# Altium schematic sheet Analog Channel.SchDoc
size A
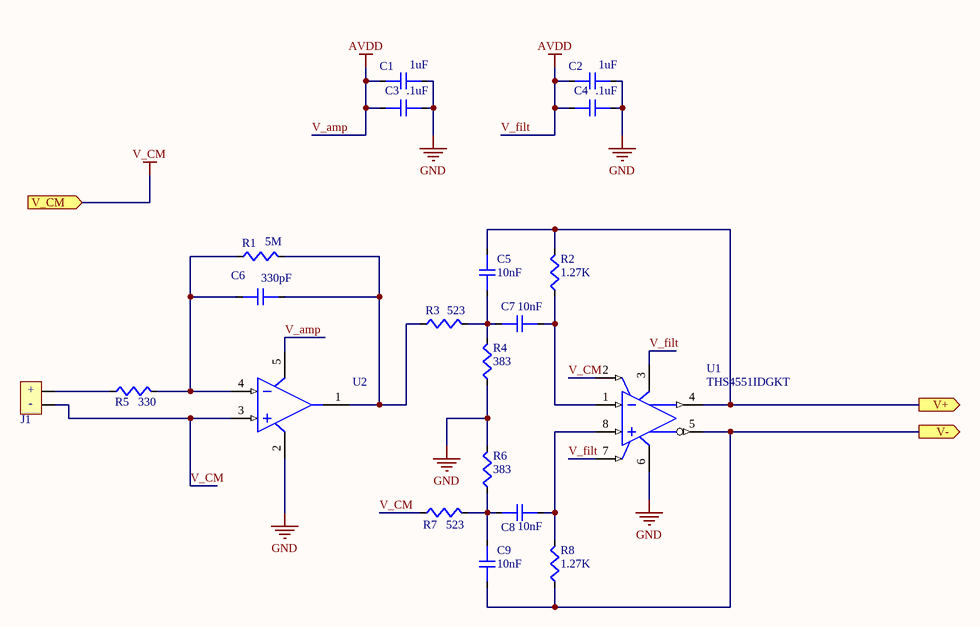
[diagram p0: Analog Channel.SchDoc]

## Parts
C1  1uF  [C0603]
C2  1uF  [C0603]
C3  .1uF  [C0603]
C4  .1uF  [C0603]
C5  10nF  [C0603]
C6  330pF  [C0603]
C7  10nF  [C0603]
C8  10nF  [C0603]
C9  10nF  [C0603]
J1  J  [EPC.00.250.NTN]  (value not drawn)
R1  5M  [R0603]
R2  1.27K  [R0603]
R3  523  [R0603]
R4  383  [R0603]
R5  330  [R0603]
R6  383  [R0603]
R7  523  [R0603]
R8  1.27K  [R0603]
U1  THS4551IDGKT  [8-VSSOP-THS4551]
U2  OPA320  [SOT-23-5]  (value not drawn)

## Ports
V+ (out), V- (out), V_CM (in)

## Nets
GND: C1.1 C2.1 C3.2 C4.2 R4.1 R6.2 U1.6(VS-) U2.2(VS-)
V_amp: C1.2 C2.2 C3.1 C4.1 U1.3(VS+) U1.7(~{PD}) U2.5(VS+)  [also labelled AVDD, V_filt]
V_CM: J1.2 R7.1 U1.2(VOCM) U2.3(+IN) ; port V_CM
V+: C5.2 R2.2 U1.4(VOUT+) ; port V+
V-: C9.1 R8.1 U1.5(VOUT-) ; port V-
NetC5_1: C5.1 C7.1 R3.2 R4.2
NetC6_1: C6.1 R1.1 R5.2 U2.4(-IN)
NetC6_2: C6.2 R1.2 R3.1 U2.1(OUT)
NetC7_2: C7.2 R2.1 U1.1(VIN-)
NetC8_1: C8.1 C9.2 R6.1 R7.2
NetC8_2: C8.2 R8.2 U1.8(VIN+)
NetJ1_1: J1.1 R5.1

## Notes on the sheet
- (in symbol hydrophone_connector) +; -

## Library data of the parts
C1 C2 = CL10B105KO8NNNC: Cap Ceramic 1uF 16V X7R 10% SMD 0603 125C T/R; Manufacturer 1: Samsung; Supplier 1: Digi-Key; Supplier Part Number 1: 1276-1019-1-ND; Manufacturer Part Number 1: CL10B105KO8NNNC; Stock 1: 4048324; Pricing 1: 1=0.10000, 10=0.04800, 100=0.02120, 500=0.01516, 1000=0.01192 (USD); RoHS: Yes; Mount: Surface Mount; Case/Package: 0603; Case Code (Metric): 1608; Case Code (Imperial): 0603; Material: Ceramic; Min Operating Temperature: -55°C; Max Operating Temperature: 125°C; Packaging: Tape and Reel; Tolerance: 10%; Capacitance: 1uF; Voltage Rating: 16V; Dielectric: X7R; Voltage: 16V; Voltage Rating (DC): 16V; Length: 1.6mm; Height: 0.8mm; Width: 0.031inch; Thickness: 0.035inch; Depth: 0.8mm; Radiation Hardening: No; Lead Free: Lead Free; ComponentLink1URL: https://datasheet.ciiva.com/15195/getdatasheetpartid-357418-15195728.pdf?src-supplier=Verical; ComponentLink1Description: https://datasheet.ciiva.com/15195/getdatasheetpartid-357418-15195728.pdf?src-supplier=Verical; ComponentLink2URL: https://datasheet.ciiva.com/29198/458176-da-01-en-vs-kondensator-0603-29198478.pdf?src-supplier=Conrad; ComponentLink2Description: https://datasheet.ciiva.com/29198/458176-da-01-en-vs-kondensator-0603-29198478.pdf?src-supplier=Conrad
C3 C4 = VJ0603Y104JXJCW1BC: 0603 0.1 uF 16 V ±5 % Tolerance X7R SMT Multilayer Ceramic Chip Capacitor; Manufacturer 1: Vishay Vitramon; Dielectric Material: Tantalum; Tolerance: 5%; Capacitance: 100nF; Voltage Rating: 16V; Supplier 1: Digi-Key; Supplier Part Number 1: 720-1685-1-ND; Manufacturer Part Number 1: VJ0603Y104JXJCW1BC; Stock 1: 6936; Pricing 1: 1=0.20000, 10=0.13400, 100=0.06780, 500=0.04636, 1000=0.04101 (USD); RoHS: Yes; Mount: Surface Mount; Case/Package: 0603; Number of Pins: 2; Case Code (Imperial): 0603; Case Code (Metric): 1608; Contact Plating: Tin,Matte; Min Operating Temperature: -55°C; Max Operating Temperature: 125°C; Packaging: Tape and Reel; Voltage Rating (DC): 16V; Package Quantity: 4000; Dielectric: X7R; Termination: SMD/SMT; Length: 1.6mm; Height: 0.95mm; Width: 0.8mm; Depth: 0.8mm; Lead Free: Lead Free; ComponentLink1URL: https://datasheet.ciiva.com/5424/vjw1bcbascomseries-223529-5424533.pdf?src-supplier=Mouser; ComponentLink1Description: https://datasheet.ciiva.com/5424/vjw1bcbascomseries-223529-5424533.pdf?src-supplier=Mouser; ComponentLink2URL: https://datasheet.ciiva.com/11491/vjw1bcbascomseries-11491768.pdf?src-supplier=Avnet; ComponentLink2Description: https://datasheet.ciiva.com/11491/vjw1bcbascomseries-11491768.pdf?src-supplier=Avnet; ComponentLink3URL: https://datasheet.ciiva.com/16215/vjw1bcbascomseries-16215161.pdf?src-supplier=Future+Electronics; ComponentLink3Description: https://datasheet.ciiva.com/16215/vjw1bcbascomseries-16215161.pdf?src-supplier=Future+Electronics
C5 C7-C9 = C0603X103F3GACAUTO: CAP CER 10000PF 25V C0G/NP0 0603; Manufacturer 1: Murata; Manufacturer Part Number 1: GRM155R71A104JA01D; Capacitance: 100nF; Tolerance: 5%; Voltage Rating: 10V; Dielectric: X7R; Stock 1: 1113659; Pricing 1: 1=0.10000, 10=0.02800, 100=0.01240, 500=0.00886, 1000=0.00696, 2500=0.00632, 5000=0.00582 (USD); RoHS: Yes; Mount: Surface Mount; Case/Package: 0402; Case Code (Imperial): 0402; Case Code (Metric): 1005; Min Operating Temperature: -55°C; Max Operating Temperature: 125°C; Packaging: Tape and Reel; Voltage Rating (DC): 10V; Package Quantity: 10000; Termination: SMD/SMT; Length: 1mm; Height: 0.5mm; Width: 0.02inch; Thickness: 0.022inch; Depth: 0.5mm; Radiation Hardening: No; Lead Free: Lead Free; ComponentLink1URL: https://datasheet.ciiva.com/5411/product-5411135.pdf?src-supplier=Mouser; ComponentLink1Description: https://datasheet.ciiva.com/5411/product-5411135.pdf?src-supplier=Mouser; ComponentLink2URL: https://datasheet.ciiva.com/11618/c02e-11618821.pdf?src-supplier=Avnet; ComponentLink2Description: https://datasheet.ciiva.com/11618/c02e-11618821.pdf?src-supplier=Avnet; Supplier 1: Digi-Key; Supplier Part Number 1: 399-C0603X103F3GACAUTOCT-ND
C6 = CC0603KRX7R9BB331: CAP CER 330PF 50V X7R 0603; Tolerance: 10%; Insulation Resistance: 10GR; Dissipation Factor: 2.5%; RoHS: Yes; Mount: Surface Mount; Case/Package: 0603; Case Code (Imperial): 0603; Case Code (Metric): 1608; Min Operating Temperature: -55°C; Max Operating Temperature: 125°C; Capacitance: 330pF; Dielectric: X7R; Package Quantity: 1; Voltage Rating: 50V; Voltage Rating (DC): 50V; Packaging: Tape and Reel; Termination: SMD/SMT; Composition: Ceramic; Length: 1.6mm; Height: 0.8mm; Depth: 0.8mm; Width: 0.8mm; Thickness: 0.035inch; Radiation Hardening: No; REACH SVHC: Unknown; Lead Free: Lead Free; Halogen Free: Halogen Free; ComponentLink1URL: https://datasheet.ciiva.com/8033/1489800-8033879.pdf?src-supplier=Element14; ComponentLink1Description: https://datasheet.ciiva.com/8033/1489800-8033879.pdf?src-supplier=Element14; ComponentLink2URL: https://datasheet.ciiva.com/17434/upy-gphc-x7r-6-3v-to-50v-8-17434663.pdf?src-supplier=Avnet+Europe; ComponentLink2Description: https://datasheet.ciiva.com/17434/upy-gphc-x7r-6-3v-to-50v-8-17434663.pdf?src-supplier=Avnet+Europe; ComponentLink3URL: https://datasheet.ciiva.com/144/mlccorderingcode-144456.pdf?src-supplier=Digi-Key; ComponentLink3Description: https://datasheet.ciiva.com/144/mlccorderingcode-144456.pdf?src-supplier=Digi-Key; ComponentLink4URL: https://datasheet.ciiva.com/144/mlccorderingcode-144454.pdf?src-supplier=Digi-Key; ComponentLink4Description: https://datasheet.ciiva.com/144/mlccorderingcode-144454.pdf?src-supplier=Digi-Key; ComponentLink5URL: https://datasheet.ciiva.com/144/mlccorderingcode-144455.pdf?src-supplier=Digi-Key; ComponentLink5Description: https://datasheet.ciiva.com/144/mlccorderingcode-144455.pdf?src-supplier=Digi-Key; ComponentLink6URL: https://datasheet.ciiva.com/11465/upy-gphc-x7r-6-3v-to-50v-8-11465240.pdf?src-supplier=Avnet; ComponentLink6Description: https://datasheet.ciiva.com/11465/upy-gphc-x7r-6-3v-to-50v-8-11465240.pdf?src-supplier=Avnet; ComponentLink7URL: https://datasheet.ciiva.com/8033/1489800-8033881.pdf?src-supplier=Element14; ComponentLink7Description: https://datasheet.ciiva.com/8033/1489800-8033881.pdf?src-supplier=Element14; ComponentLink8URL: https://datasheet.ciiva.com/7978/1489800-7978174.pdf?src-supplier=Element14; ComponentLink8Description: https://datasheet.ciiva.com/7978/1489800-7978174.pdf?src-supplier=Element14; Supplier 1: Digi-Key; Supplier Part Number 1: 311-1186-1-ND
J1 = hydrophone_connector: Supplier 1: Digi-Key; Supplier Part Number 1: WM5378-ND; Supplier 2: Digi-Key; Supplier Part Number 2: WM8552-ND
R1 = HVC0603T5004FET: RES SMD 5M OHM 1% 1/10W 0603; Manufacturer 1: Vishay Dale; Manufacturer Part Number 1: TNPW06031K00BEEA; Resistance: 1kR; Temperature Coefficient: 25ppm/°C; Power Rating: 100mW; Voltage Rating: 75V; Stock 1: 92047; Pricing 1: 1=0.65000, 10=0.46200, 100=0.24020, 1000=0.12936, 2500=0.12760 (USD); RoHS: Yes; Mount: Surface Mount; Case/Package: 0603; Weight: 7.1E-05oz; Contact Plating: Tin; Case Code (Metric): 1608; Case Code (Imperial): 0603; Min Operating Temperature: -55°C; Max Operating Temperature: 125°C; Tolerance: 1%; Composition: Thin Film; Packaging: Tape and Reel; Package Quantity: 1; Number of Terminations: 2; Termination: SMD/SMT; Military Standard: Not; Max Power Dissipation: 100mW; Voltage Rating (DC): 75V; Features: Moisture Resistant,Automotive AEC-Q200,Anti-Sulfur; Length: 1.6mm; Height: 0.45mm; Width: 0.033inch; Depth: 0.85mm; Radiation Hardening: No; REACH SVHC: Unknown; Lead Free: Lead Free; ComponentLink1URL: https://datasheet.ciiva.com/2528/tnpw-e3-2528472.pdf?src-supplier=Digi-Key; ComponentLink1Description: https://datasheet.ciiva.com/2528/tnpw-e3-2528472.pdf?src-supplier=Digi-Key; ComponentLink2URL: https://datasheet.ciiva.com/2528/tnpw-e3-2528473.pdf?src-supplier=Digi-Key; ComponentLink2Description: https://datasheet.ciiva.com/2528/tnpw-e3-2528473.pdf?src-supplier=Digi-Key; ComponentLink3URL: https://datasheet.ciiva.com/9112/tnpw-e3-9112138.pdf?src-supplier=Avnet; ComponentLink3Description: https://datasheet.ciiva.com/9112/tnpw-e3-9112138.pdf?src-supplier=Avnet; ComponentLink4URL: https://datasheet.ciiva.com/16391/tnpw-e3-16391675.pdf?src-supplier=Future+Electronics; ComponentLink4Description: https://datasheet.ciiva.com/16391/tnpw-e3-16391675.pdf?src-supplier=Future+Electronics; ComponentLink5URL: https://datasheet.ciiva.com/9112/tnpw-e3-9112141.pdf?src-supplier=Avnet; ComponentLink5Description: https://datasheet.ciiva.com/9112/tnpw-e3-9112141.pdf?src-supplier=Avnet; ComponentLink6URL: https://datasheet.ciiva.com/16782/70201627-16782047.pdf?src-supplier=Allied+Electronics; ComponentLink6Description: https://datasheet.ciiva.com/16782/70201627-16782047.pdf?src-supplier=Allied+Electronics; Supplier 1: Digi-Key; Supplier Part Number 1: HVC0603T5004FETCT-ND
R2 R8 = 2-2176088-2: RES SMD 1.27K OHM 0.1% 1/6W 0603; Manufacturer 1: Vishay Dale; Manufacturer Part Number 1: TNPW060310K0BEEA; Resistance: 10kR; Tolerance: 1%; Temperature Coefficient: 25ppm/°C; Power Rating: 100mW; Voltage Rating: 75V; Stock 1: 296181; Pricing 1: 1=0.65000, 10=0.46200, 100=0.24020, 1000=0.12936, 2500=0.12760 (USD); RoHS: Yes; Mount: Surface Mount; Case/Package: 0603; Weight: 7.1E-05oz; Contact Plating: Tin; Case Code (Metric): 1608; Case Code (Imperial): 0603; Min Operating Temperature: -55°C; Max Operating Temperature: 125°C; Composition: Thin Film; Packaging: Tape and Reel; Package Quantity: 1; Number of Terminations: 2; Termination: SMD/SMT; Military Standard: Not; Max Power Dissipation: 100mW; Features: Moisture Resistant,Automotive AEC-Q200,Anti-Sulfur; Length: 1.6mm; Height: 0.022inch; Width: 0.033inch; Depth: 0.85mm; Radiation Hardening: No; REACH SVHC: Unknown; ComponentLink1URL: https://datasheet.ciiva.com/2483/tnpw-e3-2483253.pdf?src-supplier=Digi-Key; ComponentLink1Description: https://datasheet.ciiva.com/2483/tnpw-e3-2483253.pdf?src-supplier=Digi-Key; ComponentLink2URL: https://datasheet.ciiva.com/17190/tnpw-e3-17190917.pdf?src-supplier=Avnet+Europe; ComponentLink2Description: https://datasheet.ciiva.com/17190/tnpw-e3-17190917.pdf?src-supplier=Avnet+Europe; ComponentLink3URL: https://datasheet.ciiva.com/2483/tnpw-e3-2483254.pdf?src-supplier=Digi-Key; ComponentLink3Description: https://datasheet.ciiva.com/2483/tnpw-e3-2483254.pdf?src-supplier=Digi-Key; ComponentLink4URL: https://datasheet.ciiva.com/2483/tnpw-e3-2483255.pdf?src-supplier=Digi-Key; ComponentLink4Description: https://datasheet.ciiva.com/2483/tnpw-e3-2483255.pdf?src-supplier=Digi-Key; ComponentLink5URL: https://datasheet.ciiva.com/16335/tnpw-e3-16335132.pdf?src-supplier=Future+Electronics; ComponentLink5Description: https://datasheet.ciiva.com/16335/tnpw-e3-16335132.pdf?src-supplier=Future+Electronics; ComponentLink6URL: https://datasheet.ciiva.com/28589/1912606-28589004.pdf?src-supplier=Element14; ComponentLink6Description: https://datasheet.ciiva.com/28589/1912606-28589004.pdf?src-supplier=Element14; ComponentLink7URL: https://datasheet.ciiva.com/7792/tnpw-e3-7792477.pdf?src-supplier=Element14; ComponentLink7Description: https://datasheet.ciiva.com/7792/tnpw-e3-7792477.pdf?src-supplier=Element14; ComponentLink8URL: https://datasheet.ciiva.com/9050/tnpw-e3-9050974.pdf?src-supplier=Avnet; ComponentLink8Description: https://datasheet.ciiva.com/9050/tnpw-e3-9050974.pdf?src-supplier=Avnet; Supplier 1: Digi-Key; Supplier Part Number 1: A110118CT-ND
R3 R7 = RP73PF1J523RBTDF: RES SMD 523 OHM 0.1% 1/6W 0603; Manufacturer 1: Vishay Dale; Manufacturer Part Number 1: TNPW060310K0BEEA; Resistance: 10kR; Tolerance: 1%; Temperature Coefficient: 25ppm/°C; Power Rating: 100mW; Voltage Rating: 75V; Stock 1: 296181; Pricing 1: 1=0.65000, 10=0.46200, 100=0.24020, 1000=0.12936, 2500=0.12760 (USD); RoHS: Yes; Mount: Surface Mount; Case/Package: 0603; Weight: 7.1E-05oz; Contact Plating: Tin; Case Code (Metric): 1608; Case Code (Imperial): 0603; Min Operating Temperature: -55°C; Max Operating Temperature: 125°C; Composition: Thin Film; Packaging: Tape and Reel; Package Quantity: 1; Number of Terminations: 2; Termination: SMD/SMT; Military Standard: Not; Max Power Dissipation: 100mW; Features: Moisture Resistant,Automotive AEC-Q200,Anti-Sulfur; Length: 1.6mm; Height: 0.022inch; Width: 0.033inch; Depth: 0.85mm; Radiation Hardening: No; REACH SVHC: Unknown; ComponentLink1URL: https://datasheet.ciiva.com/2483/tnpw-e3-2483253.pdf?src-supplier=Digi-Key; ComponentLink1Description: https://datasheet.ciiva.com/2483/tnpw-e3-2483253.pdf?src-supplier=Digi-Key; ComponentLink2URL: https://datasheet.ciiva.com/17190/tnpw-e3-17190917.pdf?src-supplier=Avnet+Europe; ComponentLink2Description: https://datasheet.ciiva.com/17190/tnpw-e3-17190917.pdf?src-supplier=Avnet+Europe; ComponentLink3URL: https://datasheet.ciiva.com/2483/tnpw-e3-2483254.pdf?src-supplier=Digi-Key; ComponentLink3Description: https://datasheet.ciiva.com/2483/tnpw-e3-2483254.pdf?src-supplier=Digi-Key; ComponentLink4URL: https://datasheet.ciiva.com/2483/tnpw-e3-2483255.pdf?src-supplier=Digi-Key; ComponentLink4Description: https://datasheet.ciiva.com/2483/tnpw-e3-2483255.pdf?src-supplier=Digi-Key; ComponentLink5URL: https://datasheet.ciiva.com/16335/tnpw-e3-16335132.pdf?src-supplier=Future+Electronics; ComponentLink5Description: https://datasheet.ciiva.com/16335/tnpw-e3-16335132.pdf?src-supplier=Future+Electronics; ComponentLink6URL: https://datasheet.ciiva.com/28589/1912606-28589004.pdf?src-supplier=Element14; ComponentLink6Description: https://datasheet.ciiva.com/28589/1912606-28589004.pdf?src-supplier=Element14; ComponentLink7URL: https://datasheet.ciiva.com/7792/tnpw-e3-7792477.pdf?src-supplier=Element14; ComponentLink7Description: https://datasheet.ciiva.com/7792/tnpw-e3-7792477.pdf?src-supplier=Element14; ComponentLink8URL: https://datasheet.ciiva.com/9050/tnpw-e3-9050974.pdf?src-supplier=Avnet; ComponentLink8Description: https://datasheet.ciiva.com/9050/tnpw-e3-9050974.pdf?src-supplier=Avnet; Supplier 1: Digi-Key; Supplier Part Number 1: A110081CT-ND
R4 R6 = RP73PF1J383RBTDF: RES SMD 383 OHM ±0.1% 0.167W, 1/6W Chip Resistor 0603 (1608 Metric) - Thin Film; Manufacturer 1: Vishay Dale; Manufacturer Part Number 1: TNPW060310K0BEEA; Resistance: 10kR; Tolerance: 1%; Temperature Coefficient: 25ppm/°C; Power Rating: 100mW; Voltage Rating: 75V; Stock 1: 296181; Pricing 1: 1=0.65000, 10=0.46200, 100=0.24020, 1000=0.12936, 2500=0.12760 (USD); RoHS: Yes; Mount: Surface Mount; Case/Package: 0603; Weight: 7.1E-05oz; Contact Plating: Tin; Case Code (Metric): 1608; Case Code (Imperial): 0603; Min Operating Temperature: -55°C; Max Operating Temperature: 125°C; Composition: Thin Film; Packaging: Tape and Reel; Package Quantity: 1; Number of Terminations: 2; Termination: SMD/SMT; Military Standard: Not; Max Power Dissipation: 100mW; Features: Moisture Resistant,Automotive AEC-Q200,Anti-Sulfur; Length: 1.6mm; Height: 0.022inch; Width: 0.033inch; Depth: 0.85mm; Radiation Hardening: No; REACH SVHC: Unknown; ComponentLink1URL: https://datasheet.ciiva.com/2483/tnpw-e3-2483253.pdf?src-supplier=Digi-Key; ComponentLink1Description: https://datasheet.ciiva.com/2483/tnpw-e3-2483253.pdf?src-supplier=Digi-Key; ComponentLink2URL: https://datasheet.ciiva.com/17190/tnpw-e3-17190917.pdf?src-supplier=Avnet+Europe; ComponentLink2Description: https://datasheet.ciiva.com/17190/tnpw-e3-17190917.pdf?src-supplier=Avnet+Europe; ComponentLink3URL: https://datasheet.ciiva.com/2483/tnpw-e3-2483254.pdf?src-supplier=Digi-Key; ComponentLink3Description: https://datasheet.ciiva.com/2483/tnpw-e3-2483254.pdf?src-supplier=Digi-Key; ComponentLink4URL: https://datasheet.ciiva.com/2483/tnpw-e3-2483255.pdf?src-supplier=Digi-Key; ComponentLink4Description: https://datasheet.ciiva.com/2483/tnpw-e3-2483255.pdf?src-supplier=Digi-Key; ComponentLink5URL: https://datasheet.ciiva.com/16335/tnpw-e3-16335132.pdf?src-supplier=Future+Electronics; ComponentLink5Description: https://datasheet.ciiva.com/16335/tnpw-e3-16335132.pdf?src-supplier=Future+Electronics; ComponentLink6URL: https://datasheet.ciiva.com/28589/1912606-28589004.pdf?src-supplier=Element14; ComponentLink6Description: https://datasheet.ciiva.com/28589/1912606-28589004.pdf?src-supplier=Element14; ComponentLink7URL: https://datasheet.ciiva.com/7792/tnpw-e3-7792477.pdf?src-supplier=Element14; ComponentLink7Description: https://datasheet.ciiva.com/7792/tnpw-e3-7792477.pdf?src-supplier=Element14; ComponentLink8URL: https://datasheet.ciiva.com/9050/tnpw-e3-9050974.pdf?src-supplier=Avnet; ComponentLink8Description: https://datasheet.ciiva.com/9050/tnpw-e3-9050974.pdf?src-supplier=Avnet; Supplier 1: Digi-Key; Supplier Part Number 1: A110068CT-ND
R5 = MCT06030C3300FP500: RES SMD 330 OHM 1% 1/8W 0603; Manufacturer 1: Vishay Beyschlag; Resistance: 330R; Power Rating: 125mW; Voltage Rating: 75V; Temperature Coefficient: 50ppm/°C; Supplier 1: Digi-Key; Supplier Part Number 1: MCT0603-330-CFCT-ND; Manufacturer Part Number 1: MCT06030C3300FP500; Stock 1: 133742; Pricing 1: 1=0.18000, 10=0.15200, 100=0.05960, 1000=0.02495, 2500=0.02287 (USD); RoHS: Yes; Case/Package: 0603; Case Code (Metric): 1608; Case Code (Imperial): 0603; Contact Plating: Tin; Min Operating Temperature: -55°C; Max Operating Temperature: 125°C; Package Quantity: 1; Tolerance: 1%; Packaging: Tape and Reel; Composition: Thin Film; Number of Terminations: 2; Military Standard: Not; Max Power Dissipation: 125mW; Voltage Rating (DC): 75V; Length: 0.061inch; Height: 0.022inch; Width: 0.033inch; Depth: 0.85mm; Radiation Hardening: No; REACH SVHC: No SVHC; Lead Free: Lead Free; ComponentLink1URL: https://datasheet.ciiva.com/2470/mc-pro-2470441.pdf?src-supplier=Digi-Key; ComponentLink1Description: https://datasheet.ciiva.com/2470/mc-pro-2470441.pdf?src-supplier=Digi-Key; ComponentLink2URL: https://datasheet.ciiva.com/2470/mc-pro-2470442.pdf?src-supplier=Digi-Key; ComponentLink2Description: https://datasheet.ciiva.com/2470/mc-pro-2470442.pdf?src-supplier=Digi-Key; ComponentLink3URL: https://datasheet.ciiva.com/2470/mc-pro-2470443.pdf?src-supplier=Digi-Key; ComponentLink3Description: https://datasheet.ciiva.com/2470/mc-pro-2470443.pdf?src-supplier=Digi-Key; ComponentLink4URL: https://datasheet.ciiva.com/16892/mc-pro-16892683.pdf?src-supplier=Avnet+Europe; ComponentLink4Description: https://datasheet.ciiva.com/16892/mc-pro-16892683.pdf?src-supplier=Avnet+Europe; ComponentLink5URL: https://datasheet.ciiva.com/8898/mc-pro-8898943.pdf?src-supplier=Avnet; ComponentLink5Description: https://datasheet.ciiva.com/8898/mc-pro-8898943.pdf?src-supplier=Avnet
U1 = THS4551IDGKT: Low Noise, Precision, 150MHz, Fully Differential Amplifier 8-VSSOP -40 to 125; Manufacturer 1: Texas Instruments; Number of Channels: 1; Slew Rate: 220V/µs; Output Current per Channel: 65mA; Gain Bandwidth Product: 135MHz; Input Bias Current: 1uA; Input Offset Voltage (Vos): 50uV; Operating Supply Current: 1.35mA; Supplier 1: Digi-Key; Supplier Part Number 1: 296-44771-1-ND; Manufacturer Part Number 1: THS4551IDGKT; Stock 1: 3028; Pricing 1: 1=3.84000, 10=3.44900, 100=2.82600 (USD); Mount: Surface Mount; Case/Package: VSSOP; Number of Pins: 8; Min Operating Temperature: -40°C; Max Operating Temperature: 125°C; -3db Bandwidth: 150MHz; Packaging: Cut Tape; Number of Circuits: 1; Number of Amplifiers: 1; Bandwidth: 135MHz; REACH SVHC: No SVHC; Lead Free: Lead Free; ComponentLink1URL: http://www.ti.com/lit/ds/symlink/ths4551.pdf?src-supplier=Digi-Key; ComponentLink1Description: http://www.ti.com/lit/ds/symlink/ths4551.pdf?src-supplier=Digi-Key; ComponentLink2URL: http://www.ti.com/general/docs/lit/getliterature.tsp?genericPartNumber=THS4551&fileType=pdf&src-supplier=Farnell; ComponentLink2Description: http://www.ti.com/general/docs/lit/getliterature.tsp?genericPartNumber=THS4551&fileType=pdf&src-supplier=Farnell; ComponentLink3URL: http://www.farnell.com/datasheets/2148327.pdf?src-supplier=Element14; ComponentLink3Description: http://www.farnell.com/datasheets/2148327.pdf?src-supplier=Element14; ComponentLink4URL: https://octopart.com/click/track?ai=2118&ct=datasheets&sig=0013830&at=physicalpart&sid=370&ppid=71776714&hlid=24961842&src-supplier=TI+store; ComponentLink4Description: https://octopart.com/click/track?ai=2118&ct=datasheets&sig=0013830&at=physicalpart&sid=370&ppid=71776714&hlid=24961842&src-supplier=TI+store; ComponentLink5URL: http://sigma.octopart.com/49250154/technical_drawing/Texas-Instruments-THS4551IDGKT.pdf?src-supplier=TI+store; ComponentLink5Description: http://sigma.octopart.com/49250154/technical_drawing/Texas-Instruments-THS4551IDGKT.pdf?src-supplier=TI+store; ComponentLink6URL: http://datasheet.octopart.com/THS4551IDGKT-Texas-Instruments-datasheet-78835010.pdf?src-supplier=Element14; ComponentLink6Description: http://datasheet.octopart.com/THS4551IDGKT-Texas-Instruments-datasheet-78835010.pdf?src-supplier=Element14; ComponentLink7URL: http://datasheet.octopart.com/THS4551IDGKT-Texas-Instruments-datasheet-67294894.pdf?src-supplier=Newark; ComponentLink7Description: http://datasheet.octopart.com/THS4551IDGKT-Texas-Instruments-datasheet-67294894.pdf?src-supplier=Newark; RoHS: No; ComponentLink8URL: https://www.te.com/commerce/DocumentDelivery/DDEController?Action=srchrtrv&DocNm=1773204-3&DocType=DS&DocLang=English&src-supplier=Digi-Key; ComponentLink8Description: https://www.te.com/commerce/DocumentDelivery/DDEController?Action=srchrtrv&DocNm=1773204-3&DocType=DS&DocLang=English&src-supplier=Digi-Key; ComponentLink9URL: https://www.te.com/commerce/DocumentDelivery/DDEController?Action=srchrtrv&amp;DocNm=1773204-3&amp;DocType=DS&amp;DocLang=English&src-supplier=Digi-Key; ComponentLink9Description: https://www.te.com/commerce/DocumentDelivery/DDEController?Action=srchrtrv&amp;DocNm=1773204-3&amp;DocType=DS&amp;DocLang=English&src-supplier=Digi-Key
U2 = OPA320AQDBVRQ1: General Purpose Amplifier Circuit Rail-to-Rail SOT-23-5; Manufacturer 1: Texas Instruments; Manufacturer Part Number 1: OPA325IDBVR; Supplier 1: Digi-Key; Supplier Part Number 1: 296-OPA325IDBVRCT-ND; Stock 1: 2034; Pricing 1: 1=1.69000, 10=1.51600, 25=1.43000, 100=1.14400, 250=1.00100, 500=0.97240, 1000=0.77220 (USD); RoHS: No